# Altium schematic sheet [02] - SCHEMATIC.SchDoc: =title
size A3; PageSetup: Record=PageOptions|CenterHorizontal=True|CenterVertical=True|PrintScale=1.00|XCorrection=1.00|YCorrection=1.00|PrintKind=0|BorderSize=5000000|LeftOffset=0|BottomOffset=0|Orientation=2|PaperLength=1000|PaperWidth=1000|Scale=100|PaperSource=15|PrintQuality=600|MediaType=1|DitherType=10|PaperKind=Letter|PrintScaleMode=1; DocumentNumber: 3; SheetNumber: 3; SheetTotal: 4
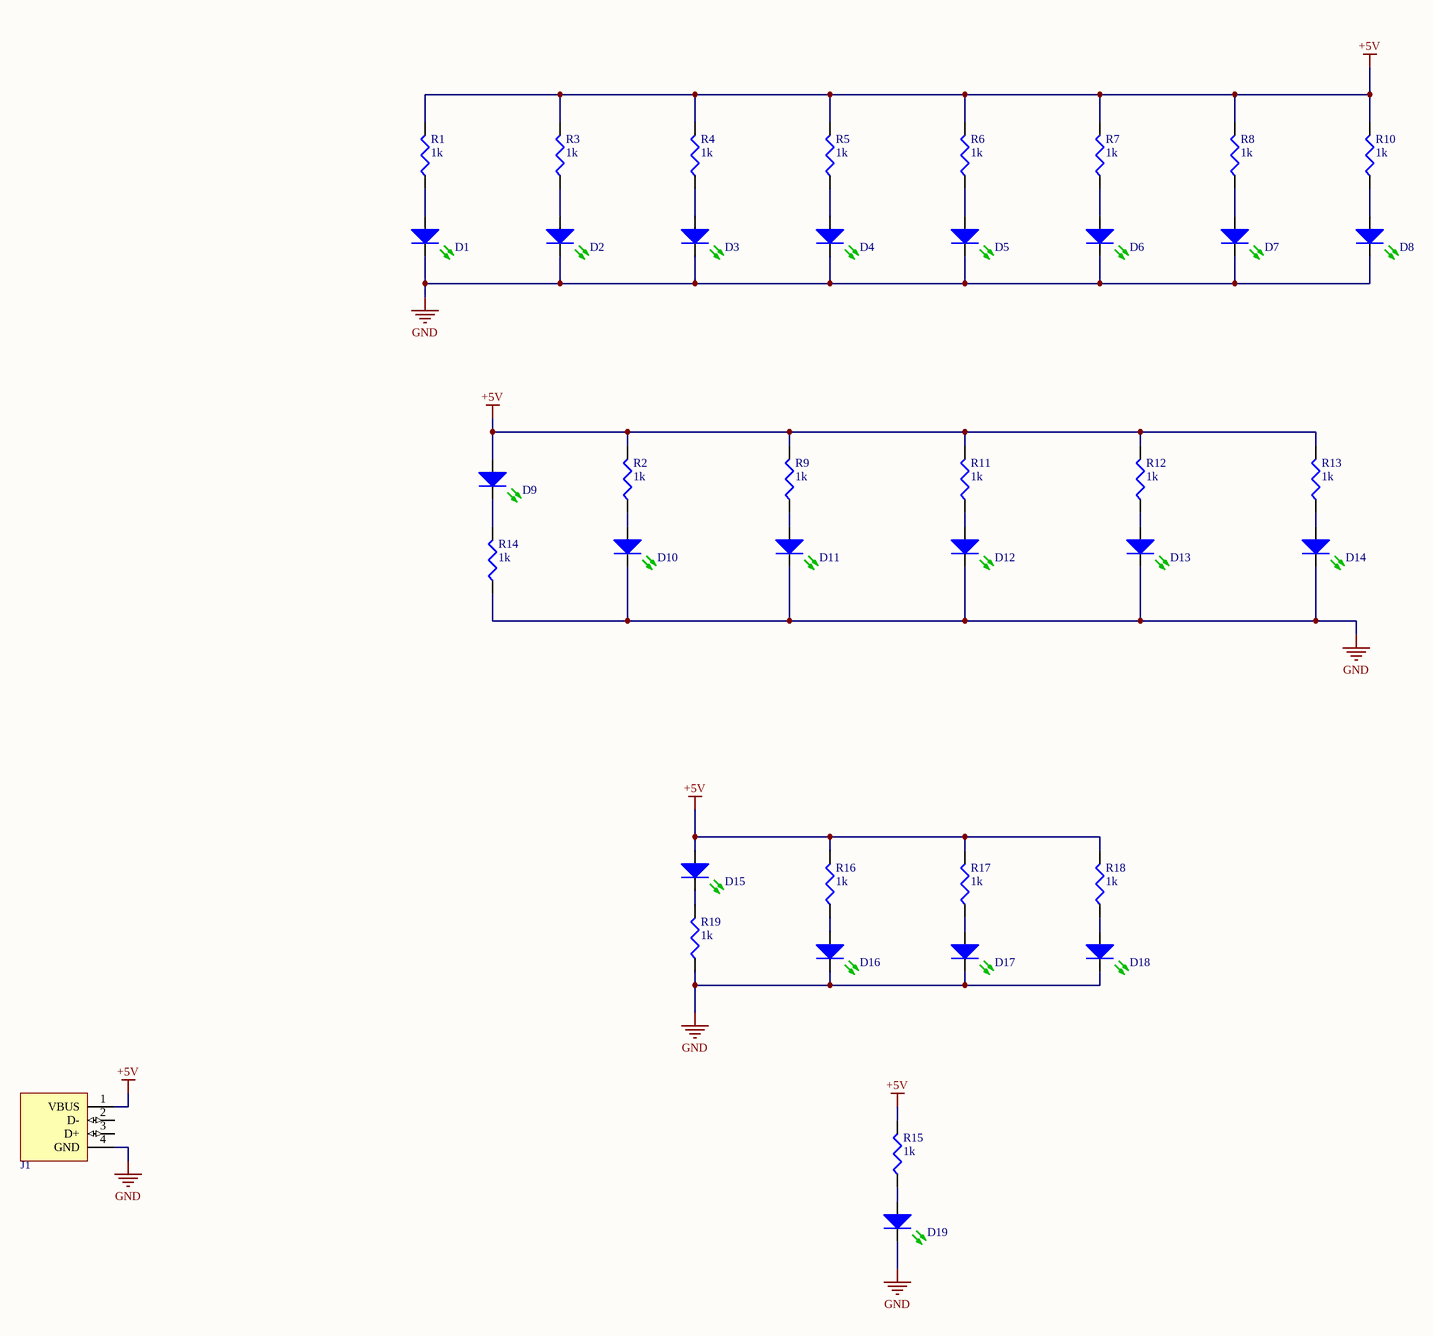
[diagram p0: [02] - SCHEMATIC.SchDoc]

## Parts
D1  FYL-3014PGC1A  [LED_THT_Type_3mm_GREEN]  (value not drawn)
D2  FYL-3014PGC1A  [LED_THT_Type_3mm_GREEN]  (value not drawn)
D3  FYL-3014PGC1A  [LED_THT_Type_3mm_GREEN]  (value not drawn)
D4  FYL-3014PGC1A  [LED_THT_Type_3mm_GREEN]  (value not drawn)
D5  FYL-3014PGC1A  [LED_THT_Type_3mm_GREEN]  (value not drawn)
D6  FYL-3014PGC1A  [LED_THT_Type_3mm_GREEN]  (value not drawn)
D7  FYL-3014PGC1A  [LED_THT_Type_3mm_GREEN]  (value not drawn)
D8  FYL-3014PGC1A  [LED_THT_Type_3mm_GREEN]  (value not drawn)
D9  FYL-3014PGC1A  [LED_THT_Type_3mm_GREEN]  (value not drawn)
D10  FYL-3014PGC1A  [LED_THT_Type_3mm_GREEN]  (value not drawn)
D11  FYL-3014PGC1A  [LED_THT_Type_3mm_GREEN]  (value not drawn)
D12  FYL-3014PGC1A  [LED_THT_Type_3mm_GREEN]  (value not drawn)
D13  FYL-3014PGC1A  [LED_THT_Type_3mm_GREEN]  (value not drawn)
D14  FYL-3014PGC1A  [LED_THT_Type_3mm_GREEN]  (value not drawn)
D15  FYL-3014PGC1A  [LED_THT_Type_3mm_GREEN]  (value not drawn)
D16  FYL-3014PGC1A  [LED_THT_Type_3mm_GREEN]  (value not drawn)
D17  FYL-3014PGC1A  [LED_THT_Type_3mm_GREEN]  (value not drawn)
D18  FYL-3014PGC1A  [LED_THT_Type_3mm_GREEN]  (value not drawn)
D19  FYL-3014PGC1A  [LED_THT_Type_3mm_GREEN]  (value not drawn)
J1  USB_A_PCB  [USB-A-PCB]  (value not drawn)  (no BOM)
R1  1k  [R0603]
R2  1k  [R0603]
R3  1k  [R0603]
R4  1k  [R0603]
R5  1k  [R0603]
R6  1k  [R0603]
R7  1k  [R0603]
R8  1k  [R0603]
R9  1k  [R0603]
R10  1k  [R0603]
R11  1k  [R0603]
R12  1k  [R0603]
R13  1k  [R0603]
R14  1k  [R0603]
R15  1k  [R0603]
R16  1k  [R0603]
R17  1k  [R0603]
R18  1k  [R0603]
R19  1k  [R0603]

## Nets
+5V: D9.2(A) D15.2(A) J1.1(VBUS) R1.2 R2.2 R3.2 R4.2 R5.2 R6.2 R7.2 R8.2 R9.2 R10.2 R11.2 R12.2 R13.2 R15.2 R16.2 R17.2 R18.2
GND: D1.1(K) D2.1(K) D3.1(K) D4.1(K) D5.1(K) D6.1(K) D7.1(K) D8.1(K) D10.1(K) D11.1(K) D12.1(K) D13.1(K) D14.1(K) D16.1(K) D17.1(K) D18.1(K) D19.1(K) J1.4(GND) R14.1 R19.1
NetD1_2: D1.2(A) R1.1
NetD2_2: D2.2(A) R3.1
NetD3_2: D3.2(A) R4.1
NetD4_2: D4.2(A) R5.1
NetD5_2: D5.2(A) R6.1
NetD6_2: D6.2(A) R7.1
NetD7_2: D7.2(A) R8.1
NetD8_2: D8.2(A) R10.1
NetD9_1: D9.1(K) R14.2
NetD10_2: D10.2(A) R2.1
NetD11_2: D11.2(A) R9.1
NetD12_2: D12.2(A) R11.1
NetD13_2: D13.2(A) R12.1
NetD14_2: D14.2(A) R13.1
NetD15_1: D15.1(K) R19.2
NetD16_2: D16.2(A) R16.1
NetD17_2: D17.2(A) R17.1
NetD18_2: D18.2(A) R18.1
NetD19_2: D19.2(A) R15.1

Not connected (* = marked no-connect by the designer): J1 2(D-) 3(D+)

## Notes on the sheet
- Company:
- CONFIDENTAL. Do not distribute.
- Title:
- Size:
- Date:
- A3
- Number:
- Time:
- Variant:
- Revision:
- Sheet
- of
- File:
- Engineer:

## Library data of the parts
D1-D19 = LED_GREEN_THT_3MM: LED, THT 3mm, Green; Manufacturer: FORYARD; Manufacturer Part Number: FYL-3014PGC1A
J1 = USB_A_PCB: USB A PCB Edge connector
R1-R19 = R0603-1k: RES, 1k, 1%, 0.063 W, 0603; Power (Watts): 0.063W, 1/16W; .Checked PCB: OK RF; .Checked SCH: RF; Category: Resistors; Package / Case: 0603 [1608 Metric]; Tolerance: ±1%; Value: 1k; RoHS: RoHS Compliant; Composition: Thick Film; Features: -; Size / Dimension: 0.063" L x 0.031" W (1.60mm x 0.80mm); Height: 0.016" (0.40mm); Number of Terminations: 2